# EAGLE design audio-amp-max98365 (EAGLE 9.6.2)
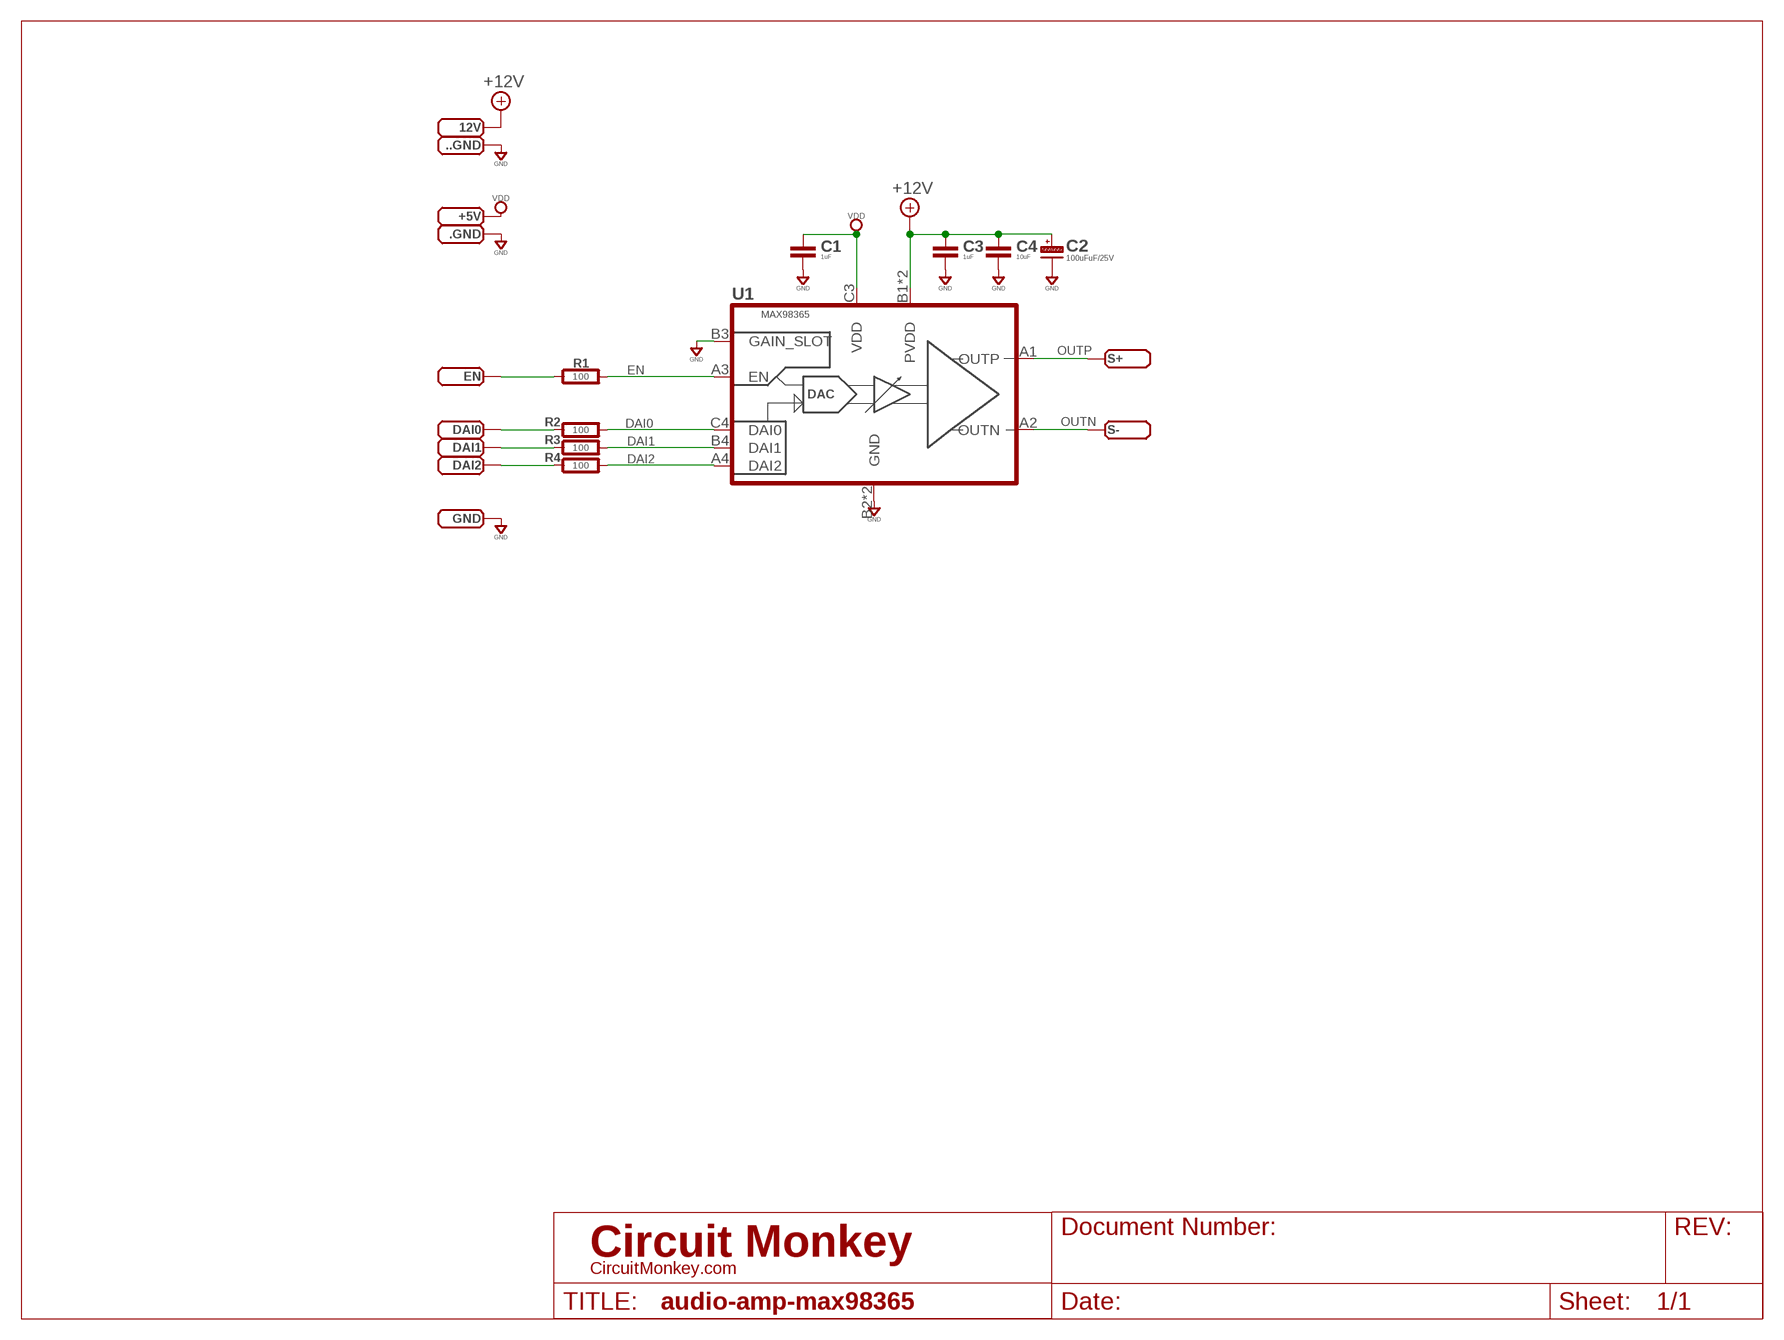
[diagram p0: schematic, sheet 1]

## Parts
12V  PADSMD-070X070  [SMD-070MIL]
+5V  PADSMD-070X070  [SMD-070MIL]
..GND  PADSMD-070X070  [SMD-070MIL]
.GND  PADSMD-070X070  [SMD-070MIL]
C1  1uF  CAPACITOR0603  [0603-CAP]
C2  100uFuF/25V  CAPACITOR_POL-ALUM-SMT-6.3  [CAP_ALUM_SMT_6.3]
C3  1uF  CAPACITOR0603  [0603-CAP]
C4  10uF  CAPACITOR0603  [0603-CAP]
DAI0  PADSMD-070X070  [SMD-070MIL]
DAI1  PADSMD-070X070  [SMD-070MIL]
DAI2  PADSMD-070X070  [SMD-070MIL]
EN  PADSMD-070X070  [SMD-070MIL]
GND  PADSMD-070X070  [SMD-070MIL]
R1  100  RESISTOR0603  [0603-RES]
R2  100  RESISTOR0603  [0603-RES]
R3  100  RESISTOR0603  [0603-RES]
R4  100  RESISTOR0603  [0603-RES]
S+  PADSMD-100X100  [SMD-100X100]
S-  PADSMD-100X100  [SMD-100X100]
U1  MAX98365  [12WLP]

## Nets
+12V: 12V.1(PAD) C2.+(P) C3.1 C4.1 U1.B1(PVDD) U1.C1(PVDD)
DAI0: R2.2 U1.C4(DAI0)
DAI1: R3.2 U1.B4(DAI1)
DAI2: R4.2 U1.A4(DAI2)
EN: R1.2 U1.A3(EN)
GND: ..GND.1(PAD) .GND.1(PAD) C1.2 C2.-(N) C3.2 C4.2 GND.1(PAD) U1.B2(GND) U1.B3(GAIN_SLOT) U1.C2(GND)
N$7: EN.1(PAD) R1.1
N$8: DAI0.1(PAD) R2.1
N$9: DAI1.1(PAD) R3.1
N$10: DAI2.1(PAD) R4.1
OUTN: S-.PAD U1.A2(OUTN)
OUTP: S+.PAD U1.A1(OUTP)
VDD: +5V.1(PAD) C1.1 U1.C3(VDD)

## Library data of the parts
12V +5V ..GND .GND DAI0 DAI1 DAI2 EN GND S+ S- = con-testpoints:PAD: Solder Pad
C1 C3 C4 = rlc:CAPACITOR: Capacitor; COST01: 0.12; COST10: 0.09; COST100: 0.05
C2 = rlc:CAPACITOR_POL: Polarized Capacitor; VALUE: XXuF/xxV - 6.3mm
R1-R4 = rlc:RESISTOR: Resistor; COST01: 0.10; COST10: 0.05; COST100: 0.02
U1 = co-maxim:MAX98365: MAX98365 Class-D Audio Amplifier, 18W; COST01: 1.75; COST10: 1.60; COST100: 1.25; MFR: Maxim; MPN: MAX98365A/C

## Board
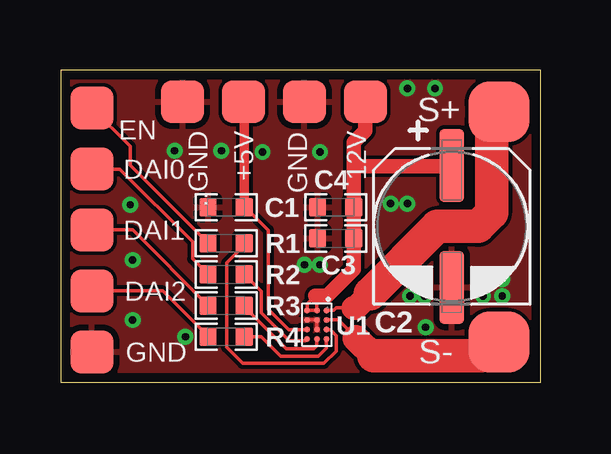
[diagram p1: board, top side]
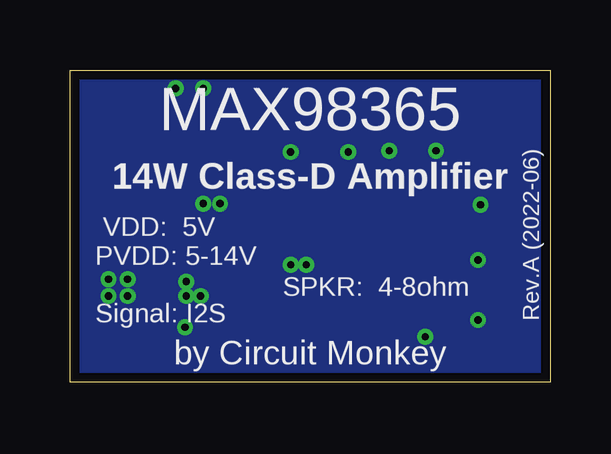
[diagram p2: board, bottom side, seen from below]

Size 20 x 13 mm. Coordinates in mm from the lower left corner, seen from the top.
Outline: 0,0 20,0 20,13 0,13 0,0
Copper layers (1*16): Top 0.0356mm / dielectric 1.5011mm / Bottom 0.0356mm
Design rules "OSH-CircuitMonkey *": minimum track width 6mil, minimum drill 12mil, track to track 6mil, track to pad 6mil, pad to pad 6mil, via to via 6mil, smd to smd 6mil, copper to edge 15mil, drill to drill 6mil, minimum pad ring 7mil, minimum via ring 7mil, stop-mask expansion 3mil, vias tented up to drill 12mil, thermal gap 10mil

### Footprints (pad centres in the part's own frame; a part is rotated, then mirrored left to right if it is on the bottom)
SMD-070MIL = smd 1.778 x 1.778: 1 0.508,0
0603-CAP = smd 0.711 x 0.762: 1 -0.752,0; 2 0.752,0
CAP_ALUM_SMT_6.3 = smd 3.048 x 1.016: + 2.54,0; - -2.54,0
0603-RES = smd 0.711 x 0.762: 1 -0.752,0; 2 0.752,0
SMD-100X100 = smd 2.54 x 2.54: PAD 0,0
12WLP = smd 0.24 x 0.24: A1 -0.6,0.4; A2 -0.2,0.4; A3 0.2,0.4; A4 0.6,0.4; B1 -0.6,0; B2 -0.2,0; B3 0.2,0; B4 0.6,0; C1 -0.6,-0.4; C2 -0.2,-0.4; C3 0.2,-0.4; C4 0.6,-0.4

### Placement (x,y rotation side)
12V  12.7,12.2 270 top
+5V  7.62,12.2 270 top
..GND  5.08,12.2 270 top
.GND  10.16,12.2 270 top
C1  6.9,7.3 180 top
C2  16.3,6.5 90 top
C3  11.46,6 180 top
C4  11.46,7.3 180 top
DAI0  0.8,8.89 0 top
DAI1  0.8,6.35 0 top
DAI2  0.8,3.81 0 top
EN  0.8,11.43 0 top
GND  0.8,1.27 0 top
R1  6.9,5.8 0 top
R2  6.9,4.5 0 top
R3  6.9,3.2 0 top
R4  6.9,1.9 0 top
S+  18.26,11.28 180 top
S-  18.26,1.69 180 top
U1  10.68,2.4 270 top

### Tracks (layer width: path | path; a pad name or v marks a point on that pad's centre or on a via)
+12V
  Top 0.152: U1.C1 U1.B1 10.68,3.52 10.6,3.6 10.28,3.28 U1.C1
  Top 0.6: 10.6,3.6 11.1,3.6 12.21,4.71 C3.1 C4.1 12.21,9 | 12V.1 12.7,10.49 12.21,10 12.21,9 | C2.+ 16.26,9 12.21,9
DAI0
  Top 0.152: U1.C4 10.2,1.73 9.53,1.73 8.35,2.9 8.35,3.8 R2.2
DAI1
  Top 0.152: U1.B4 10.68,1.52 10.55,1.4 9.4,1.4 7.65,3.15 R3.2
DAI2
  Top 0.152: R4.2 8.37,1.9 9.17,1.09 10.74,1.09 11.08,1.43 U1.A4
EN
  Top 0.152: U1.A3 11.23,2.2 11.48,1.95 11.48,1.3 10.97,0.79 7.59,0.79 6.92,1.46 6.92,4.98 7.65,5.72 R1.2
GND  (via drill 0.3)
  Top 0.152: U1.C2 U1.B2 U1.B3
  other vias: 6.7,9.65 10.16,4.9 10.8,4.9 5.2,1.9 3,2.6 3,5.1 2.9,7.4 14.45,12.25 15.6,12.25 17.6,4.3 17.6,3.6 15.16,4.2 15.16,3.6 13.75,7.45 14.45,7.45 18.4,3.6 18.4,4.3 14.56,3.6 15.21,2.3 8.41,9.6 10.81,9.6 4.75,9.65
  pour Top (rank 5): 0,0 0,13 20,13 20,0
  pour Bottom (rank 5): 0,0 0,13 20,13 20,0
N$7
  Top 0.152: EN.1 2.91,9.83 2.91,9.04 R1.1
N$8
  Top 0.152: R2.1 5.5,5.15 5.5,5.85 2.46,8.89 DAI0.1
N$9
  Top 0.152: R3.1 3,6.35 DAI1.1
N$10
  Top 0.152: R4.1 6.15,1.92 4.26,3.81 DAI2.1
OUTN
  Top 0.152: U1.A2 11.58,2.6 12.3,1.88 12.3,1.84
  Top 1.1: 13.05,1.1 12.3,1.84
  Top 1.4: S-.PAD 17.53,1.1 13.05,1.1
OUTP
  Top 0.152: U1.A1 11.38,3 11.48,3.1 12.2,3.1
  Top 1: 12.9,3.7 12.3,3.1 12.2,3.1
  Top 1.4: S+.PAD 17.96,10.97 17.96,7.06 17.4,6.5 15.7,6.5 12.9,3.7
VDD
  Top 0.152: U1.C3 9.5,2.2 8.66,3.04 8.66,6.34 7.7,7.3 C1.1
  Top 0.4: +5V.1 7.65,11.66 C1.1

### Text on the board
bPlace: MAX98365 | 14W Class-D Amplifier | VDD: 5V / PVDD: 5-14V / / Signal: I2S | Rev.A (2022-06) | SPKR: 4-8ohm | by Circuit Monkey